# Altium schematic sheet communication.SchDoc
size 431 x 279 mm; SheetNumber: 2; SheetTotal: 5
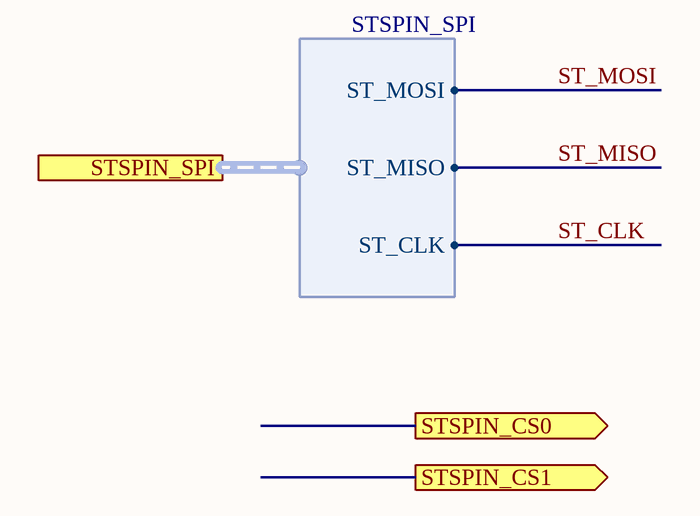
[diagram p0: communication.SchDoc]

## Ports
STSPIN_CS0 (out, see root[2B]), STSPIN_CS1 (out, see root[2B]), STSPIN_SPI (harness STSPIN_SPI, see root[2B], STSPIN[1B])

## Harnesses
STSPIN_SPI: ST_MOSI, ST_MISO, ST_CLK

## Nets
ST_CLK: port STSPIN_SPI.ST_CLK
ST_MISO: port STSPIN_SPI.ST_MISO
ST_MOSI: port STSPIN_SPI.ST_MOSI

## Notes on the sheet
- DWG. NO.
- REV.
- SHT.
- THIS DOCUMENT AND THE DATA DISCLOSED HEREIN OR HEREWITH IS THE PROPERTY OF ALTIUM LIMITED AND MAY BE FREELY DISTRIBUTED IN WHOLE. NO RIGHTS ARE RESERVED OR EXPRESS OR IMPLIED WARANTEE GIVEN.
- REVISION
- DESCRIPTION
- DATE
- APPROVED
- ENG:
- APPROVALS
- PROJECT
- DSN:
- CHK:
- REFERENCE DOCUMENTS
- PROJECT REVISION:
- TITLE
- DOCUMENT REVISION:
- DESIGN ITEM:
- BOM:
- FAB DWG:
- PCB DWG:
- ASSY DWG:
- SCALE:
- SIZE
- B
- CAGE CODE
- FILE NAME
- DWG NO.
- SHEET
- OF
- REV